# EAGLE design BR012_MKL_3310_Tender_Lichtplatine_V1 (EAGLE 5.10)
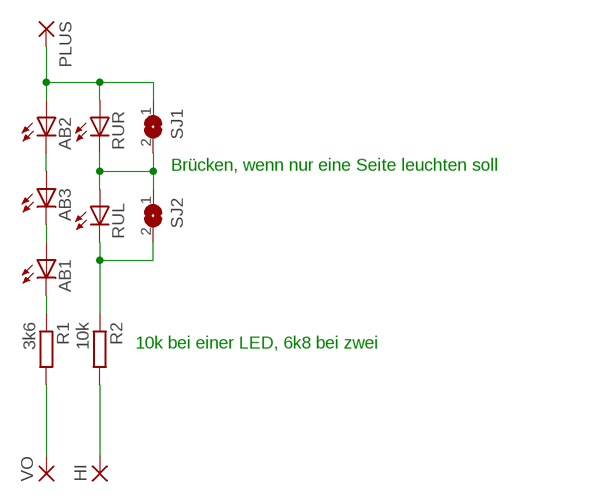
[diagram p0: schematic, sheet 1]

## Parts
AB1  LEDCHIP-LED0603  [CHIP-LED0603]
AB2  LEDCHIP-LED0603  [CHIP-LED0603]
AB3  LEDCHIP-LED0603  [CHIP-LED0603]
HI  SMD2  [SMD1,27-2,54]
PLUS  SMD2  [SMD1,27-2,54]
R1  3k6  R-EU_R0603S  [R0603S]
R2  10k  R-EU_R0603S  [R0603S]
RUL  LEDCHIP-LED0603  [CHIP-LED0603]
RUR  LEDCHIP-LED0603  [CHIP-LED0603]
SJ1  SJSS  [SJS]
SJ2  SJSS  [SJS]
VO  SMD2  [SMD1,27-2,54]

## Nets
N$1: AB2.C AB3.A
N$2: R1.2 VO.1(P)
N$3: RUL.A RUR.C SJ1.2 SJ2.1
N$4: AB1.A AB3.C
N$5: AB1.C R1.1
N$6: HI.1(P) R2.2
N$10: AB2.A PLUS.1(P) RUR.A SJ1.1
N$13: R2.1 RUL.C SJ2.2

## Notes on the sheet
- Brücken, wenn nur eine Seite leuchten soll
- 10k bei einer LED, 6k8 bei zwei

## Library data of the parts
AB1-AB3 RUL RUR = led:LED: LED OSRAM: - CHIPLED LG R971, LG N971, LY N971, LG Q971, LY Q971, LO R971, LY R971 LH N974, LH R974 LS Q976, LO Q976, LY Q976 LO Q996 - Hyper CHIPLED LW Q18S LB Q993, LB Q99A, LB R99A - SideLED LS A670, LO A670, LY A670, LG A670, LP A670 LB A673, LV A673, LT A673, LW A673 LH A674 LY A675 LS A676, LA A676, LO A676, LY A676, LW A676 LS A679, LY A679, LG A679 - Hyper Micro SIDELED® LS Y876, LA Y876, LO Y876, LY Y876 LT Y87S - SmartLED LW L88C, LW L88S LB L89C, LB L89S, LG L890 LS L89K, LO L89K, LY L89K LS L896, LA L896, LO L896, LY L896 - TOPLED LS T670, LO T670, LY T670, LG T670, LP T670 LSG T670, LSP T670, LSY T670, LOP T670, LYG T670 LG T671, LOG T671, LSG T671 LB T673, LV T673, LT T673, LW T673 LH T674 LS T676, LA T676, LO T676, LY T676, LB T676, LH T676, LSB T676, LW T676 LB T67C, LV T67C, LT T67C, LS T67K, LO T67K, LY T67K, LW E67C LS E67B, LA E67B, LO E67B, LY E67B, LB E67C, LV E67C, LT E67C LW T67C LS T679, LY T679, LG T679 LS T770, LO T770, LY T770, LG T770, LP T770 LB T773, LV T773, LT T773, LW T773 LH T774 LS E675, LA E675, LY E675, LS T675 LS T776, LA T776, LO T776, LY T776, LB T776 LHGB T686 LT T68C, LB T68C - Hyper Mini TOPLED® LB M676 - Mini TOPLED Santana® LG M470 LS M47K, LO M47K, LY M47K Source: http://www.osram.convergy.de LUXEON: - LUMILED® LXK2-PW12-R00, LXK2-PW12-S00, LXK2-PW14-U00, LXK2-PW14-V00 LXK2-PM12-R00, LXK2-PM12-S00, LXK2-PM14-U00 LXK2-PE12-Q00, LXK2-PE12-R00, LXK2-PE12-S00, LXK2-PE14-T00, LXK2-PE14-U00 LXK2-PB12-K00, LXK2-PB12-L00, LXK2-PB12-M00, LXK2-PB14-N00, LXK2-PB14-P00, LXK2-PB14-Q00 LXK2-PR12-L00, LXK2-PR12-M00, LXK2-PR14-Q00, LXK2-PR14-R00 LXK2-PD12-Q00, LXK2-PD12-R00, LXK2-PD12-S00 LXK2-PH12-R00, LXK2-PH12-S00 LXK2-PL12-P00, LXK2-PL12-Q00, LXK2-PL12-R00 Source: www.luxeon.com KINGBRIGHT: KA-3528ASYC Source: www.kingbright.com
HI PLUS VO = wirepad:SMD2: SMD PAD
R1 R2 = rcl:R-EU_: RESISTOR, European symbol
SJ1 SJ2 = jumper:SJS

## Board
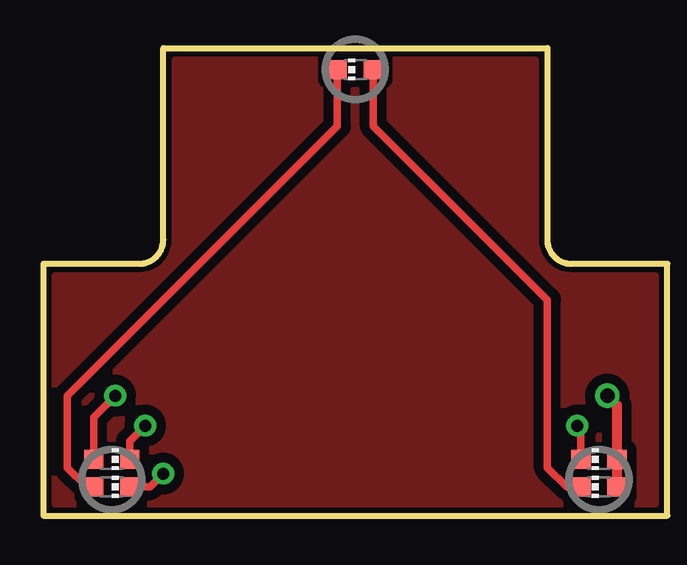
[diagram p1: board, top side]
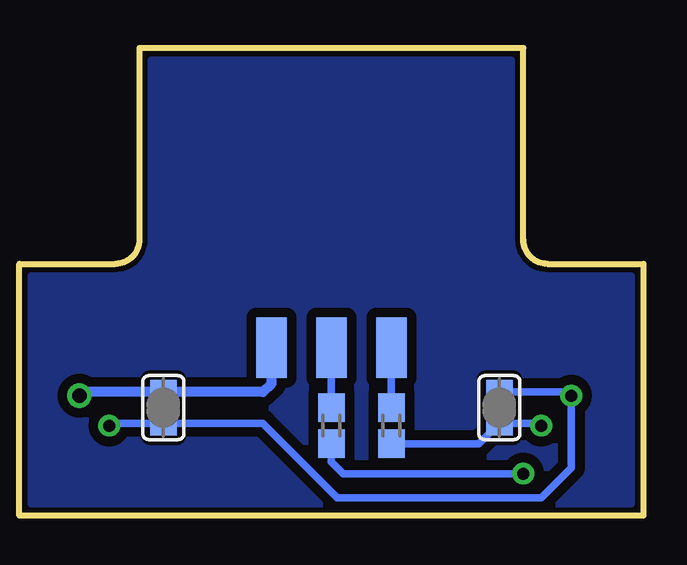
[diagram p2: board, bottom side, seen from below]

No outline drawn. Coordinates in mm, seen from the top.
Copper layers (1*16): Top 0.035mm / dielectric 1.5mm / Bottom 0.035mm
Design rules "default *": minimum track width 7mil, minimum drill 0.6mm, track to track 8mil, track to pad 8mil, pad to pad 8mil, via to via 8mil, smd to smd 8mil, copper to edge 40mil, drill to drill 8mil, minimum pad ring 10mil, minimum via ring 8mil, stop-mask expansion 4mil, vias tented up to drill 0mil, thermal gap 10mil
Milling: 10 lines

### Footprints (pad centres in the part's own frame; a part is rotated, then mirrored left to right if it is on the bottom)
CHIP-LED0603 = smd 0.8 x 0.8: A 0,-0.75; C 0,0.75
SMD1,27-2,54 = smd 1.27 x 2.54: 1 0,0
R0603S = smd 1.2 x 1.1: 1 -0.75,0; 2 0.75,0
SJS = smd 1 x 1.1: 1 -0.65,0; 2 0.65,0

### Placement (x,y rotation side)
AB1  2.85,1.2 270 top
AB2  23.15,1.2 90 top
AB3  13,18.6 90 top
HI  10.5,7 180 bottom
PLUS  15.5,7 180 bottom
R1  13,3.75 90 bottom
R2  10.5,3.75 90 bottom
RUL  2.85,2.35 270 top
RUR  23.15,2.35 90 top
SJ1  20,4.5 270 bottom
SJ2  6,4.5 270 bottom
VO  13,7 180 bottom

### Tracks (layer width: path | path; a pad name or v marks a point on that pad's centre or on a via)
N$1
  Top 0.305: AB2.C 21.8,1.2 21,2 21,9 13.75,16.25 AB3.A
N$2
  Bottom 0.305: R1.2 VO.1
N$3  (via drill 0.5)
  Top 0.305: RUL.A 2.1,4.1 v3,5 | RUR.C 22.4,3.6 v22.25,3.75
  Bottom 0.305: SJ2.1 3.15,5.15 v3,5 3,2 4.25,0.75 12.75,0.75 15.85,3.85 SJ1.2 22.15,3.85 v22.25,3.75
N$4
  Top 0.305: AB1.A 1.8,1.2 1,2 1,5 12.25,16.25 AB3.C
N$5  (via drill 0.5)
  Top 0.305: v5,1.75 4.45,1.2 AB1.C
  Bottom 0.305: R1.1 13,2.25 12.5,1.75 v5,1.75
N$6
  Bottom 0.305: R2.2 HI.1
N$7
  pour Bottom (isolate 0.406): 25.5,10 22,10 arc-90 20.5,11.5 20.5,19 5.5,19 5.5,11.5 arc-90 4,10 0.5,10 0.5,0.5 25.5,0.5
  pour Top (isolate 0.406): 25.5,10 22,10 arc-90 20.5,11.5 20.5,19 5.5,19 5.5,11.5 arc-90 4,10 0.5,10 0.5,0.5 25.5,0.5
N$10  (via drill 0.6)
  Top 0.406: AB2.A RUR.A 23.9,4.6 v23.5,5
  Bottom 0.406: v23.5,5 23.35,5.15 SJ1.1 15.85,5.15 15.5,5.5 PLUS.1
N$13  (via drill 0.5)
  Top 0.305: RUL.C 3.6,3.1 v4.25,3.75
  Bottom 0.305: v4.25,3.75 4.35,3.85 SJ2.2 6.85,3 R2.1

### Text on the board
tStop: BR012 LED | Für Märklin 3310 | design by Janik Merz
bStop: hi | vo | + | BR012 LED